# EAGLE design schema (EAGLE 8.2.2)
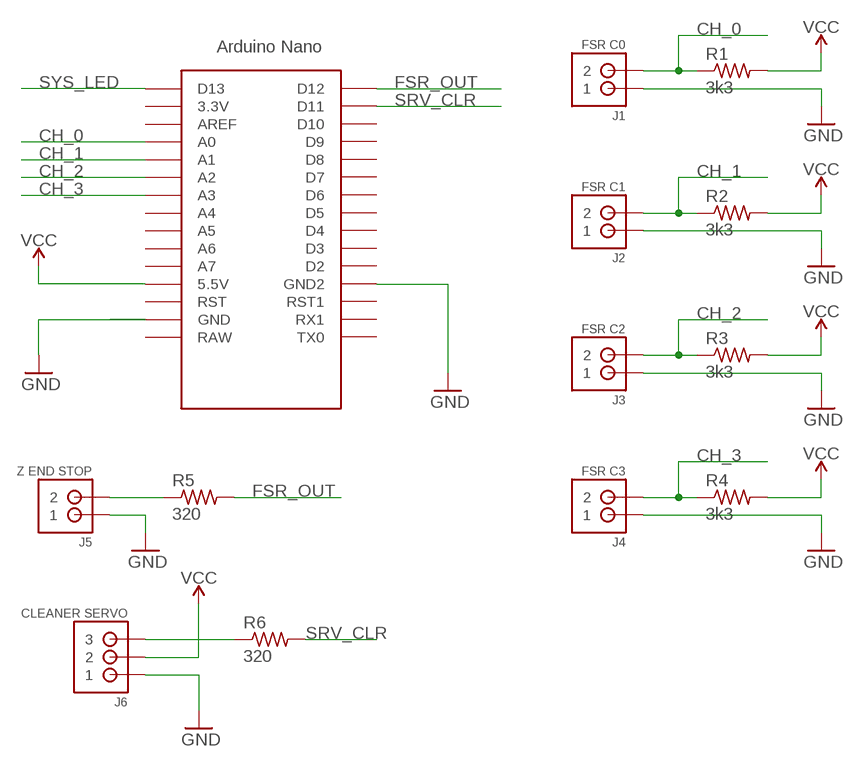
[diagram p0: schematic, sheet 1]

## Parts
J1  FSR C0  JST-PH_2-PIN_HEADER  [JST_B2B-PH_HEADER]
J2  FSR C1  JST-PH_2-PIN_HEADER  [JST_B2B-PH_HEADER]
J3  FSR C2  JST-PH_2-PIN_HEADER  [JST_B2B-PH_HEADER]
J4  FSR C3  JST-PH_2-PIN_HEADER  [JST_B2B-PH_HEADER]
J5  Z END STOP  JST-PH_2-PIN_HEADER  [JST_B2B-PH_HEADER]
J6  CLEANER SERVO  JST-PH_3-PIN_HEADER  [JST_B3B-PH_HEADER]
R1  3k3  R-US_0204/5  [0204/5]
R2  3k3  R-US_0204/5  [0204/5]
R3  3k3  R-US_0204/5  [0204/5]
R4  3k3  R-US_0204/5  [0204/5]
R5  320  R-US_0204/5  [0204/5]
R6  320  R-US_0204/5  [0204/5]
U$1  NANO  [NANO]

## Nets
CH_0: J1.P2 R1.1 U$1.A0
CH_1: J2.P2 R2.1 U$1.A1
CH_2: J3.P2 R3.1 U$1.A2
CH_3: J4.P2 R4.1 U$1.A3
FSR_OUT: R5.2 U$1.D12
GND: J1.P1 J2.P1 J3.P1 J4.P1 J5.P1 J6.P1 U$1.GND U$1.GND1(GND2)
N$1: J6.P3 R6.1
N$5: J5.P2 R5.1
SRV_CLR: R6.2 U$1.D11
SYS_LED: U$1.D13
VCC: J6.P2 R1.2 R2.2 R3.2 R4.2 U$1.5V(5.5V)
Unconnected: U$1.3.3V U$1.A4 U$1.A5 U$1.A6 U$1.A7 U$1.AREF U$1.D2 U$1.D3 U$1.D4 U$1.D5 U$1.D6 U$1.D7 U$1.D8 U$1.D9 U$1.D10 U$1.ICSP1 U$1.ICSP2 U$1.ICSP3 U$1.ICSP4 U$1.ICSP5 U$1.ICSP6 U$1.RAW U$1.RST U$1.RST1 U$1.RX1 U$1.TX0

## Library data of the parts
J1-J5 = SRG:JST-PH_2-PIN_HEADER: 2-pin JST PH Shrouded Header, top entry P/N B2B-PH-K-S Mating connector PHR-2 Mating cable assembly: Sparkfun PRT-09914 <http://www.sparkfun.com/products/9914>
J6 = SRG:JST-PH_3-PIN_HEADER: 3-pin JST PH Shrouded Header, top entry P/N B3B-PH-K-S Mating connector PHR-3
R1-R6 = adafruit:R-US_: RESISTOR, American symbol
U$1 = Arduino-clone:NANO: Arduino Nano

## Board
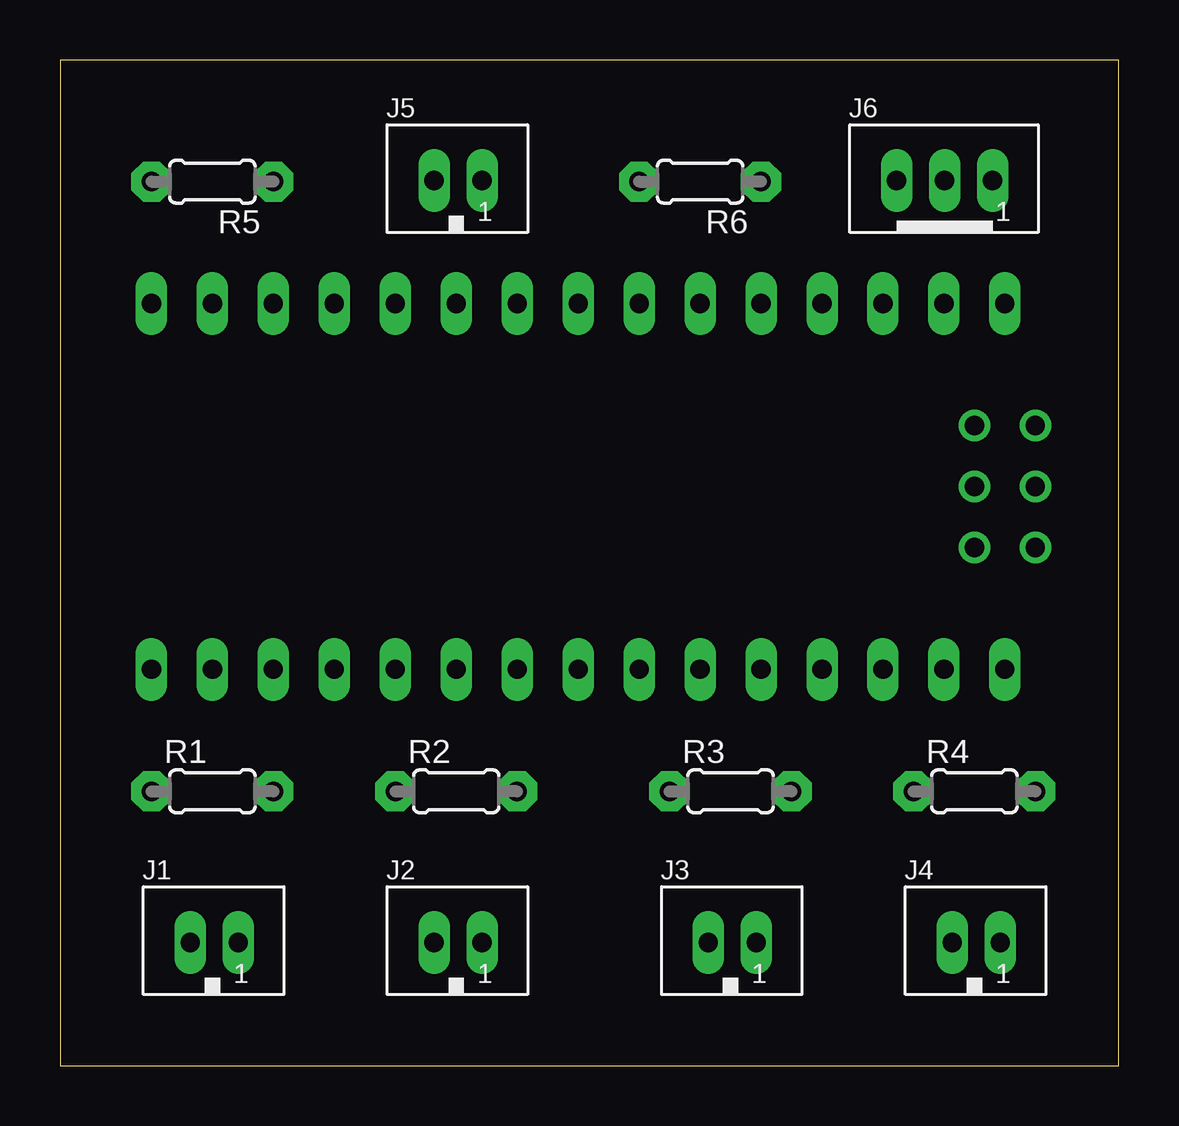
[diagram p1: board, top side]
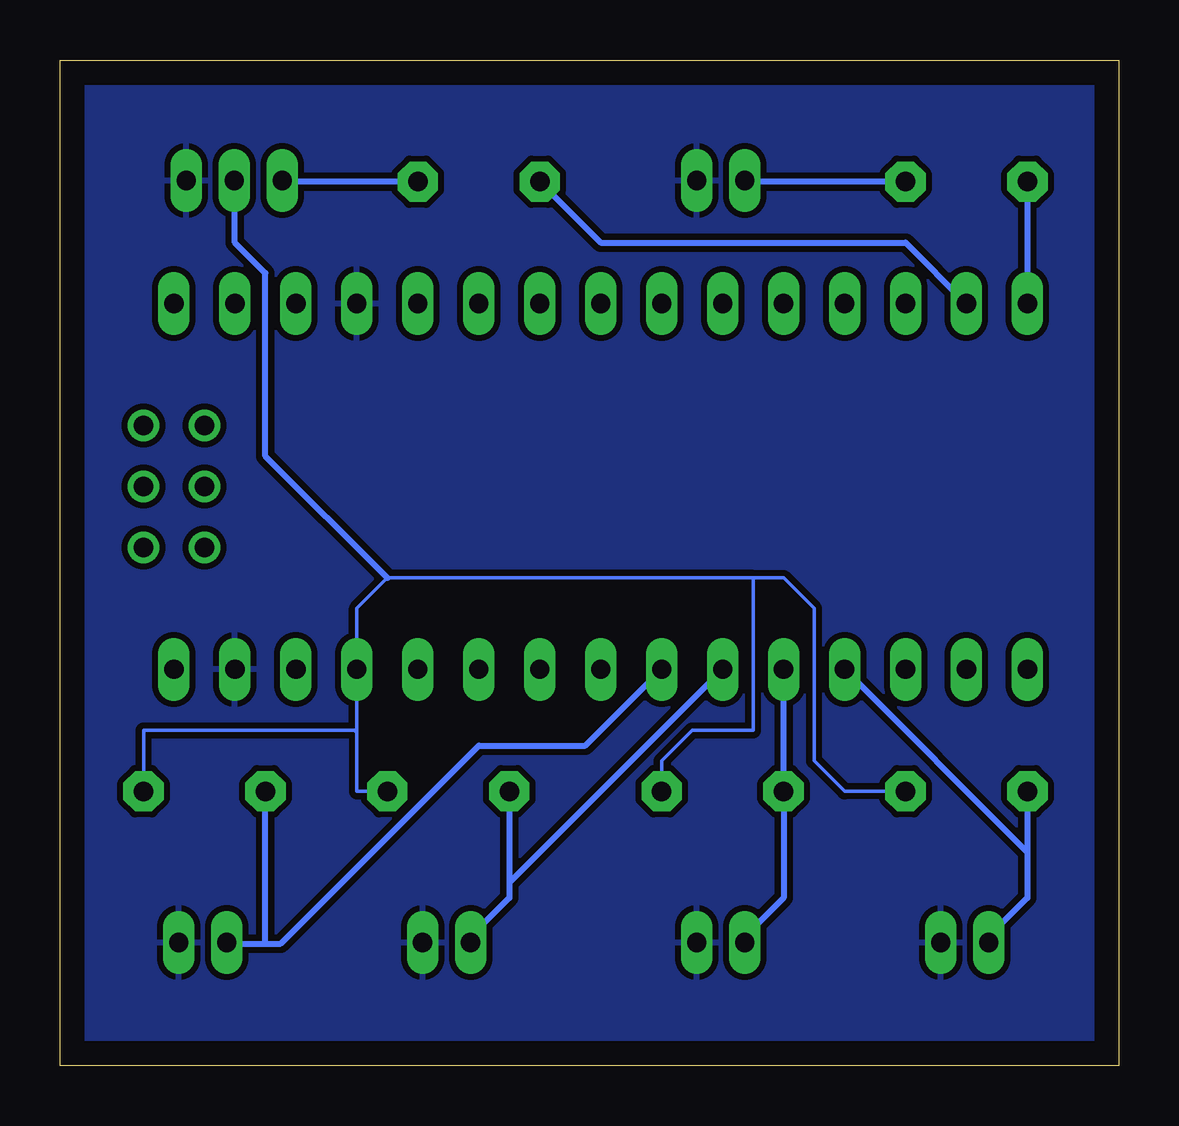
[diagram p2: board, bottom side, seen from below]

Size 44.12 x 41.9 mm. Coordinates in mm from the lower left corner, seen from the top.
Outline: 0,0 44.12,0 44.12,41.9 0,41.9 0,0
Copper layers (1*16): Top 0.035mm / dielectric 1.5mm / Bottom 0.035mm
Design rules "default *": minimum track width 10mil, minimum drill 0.35mm, track to track 10mil, track to pad 10mil, pad to pad 10mil, via to via 10mil, smd to smd 6mil, copper to edge 40mil, drill to drill 6mil, minimum pad ring 10mil, minimum via ring 8mil, stop-mask expansion 4mil, vias tented up to drill 0mil, thermal gap 10mil

### Footprints (pad centres in the part's own frame; a part is rotated, then mirrored left to right if it is on the bottom)
JST_B2B-PH_HEADER = drill 0.8 long: P1 1.075,0.048; P2 -0.925,0.048
JST_B3B-PH_HEADER = drill 0.8 long: P1 2.027,0.048; P2 0.028,0.048; P3 -1.972,0.048
0204/5 = drill 0.813 pad 1.676 octagon: 1 -2.54,0; 2 2.54,0
NANO = drill 0.8 long: 3.3V -10.16,24.13; 5V -10.16,-1.27; A0 -10.16,19.05; A1 -10.16,16.51; A2 -10.16,13.97; A3 -10.16,11.43; A4 -10.16,8.89; A5 -10.16,6.35; A6 -10.16,3.81; A7 -10.16,1.27; AREF -10.16,21.59; D2 5.08,1.27; D3 5.08,3.81; D4 5.08,6.35; D5 5.08,8.89; D6 5.08,11.43; D7 5.08,13.97; D8 5.08,16.51; D9 5.08,19.05; D10 5.08,21.59; D11 5.08,24.13; D12 5.08,26.67; D13 -10.16,26.67; GND -10.16,-6.35; GND1 5.08,-1.27; RAW -10.16,-8.89; RST -10.16,-3.81; RST1 5.08,-3.81; RX1 5.08,-6.35; TX0 5.08,-8.89 | drill 0.8: ICSP1 -5.08,-10.16; ICSP2 -5.08,-7.62; ICSP3 -2.54,-10.16; ICSP4 -2.54,-7.62; ICSP5 0,-10.16; ICSP6 0,-7.62

### Placement (x,y rotation side)
J1  6.35,5.08 0 top
J2  16.51,5.08 0 top
J3  27.94,5.08 0 top
J4  38.1,5.08 0 top
J5  16.51,36.83 0 top
J6  36.83,36.83 0 top
R1  6.35,11.43 0 top
R2  16.51,11.43 0 top
R3  27.94,11.43 0 top
R4  38.1,11.43 0 top
R5  6.35,36.83 180 top
R6  26.67,36.83 180 top
U$1  30.48,26.67 90 top

### Tracks (layer width: path | path; a pad name or v marks a point on that pad's centre or on a via)
CH_0
  Bottom 0.254: R1.1 3.81,8.89 | 3.81,8.89 3.81,6.99 5.08,5.71 J1.P2 | 3.81,8.89 U$1.A0
CH_1
  Bottom 0.254: J2.P2 15.24,5.71 13.97,6.99 R2.1 U$1.A1
CH_2
  Bottom 0.254: R3.1 25.4,7.62 | 25.4,7.62 25.4,6.99 26.67,5.71 J3.P2 | 25.4,7.62 U$1.A2
CH_3
  Bottom 0.254: U$1.A3 22.23,13.34 26.67,13.34 34.92,5.08 35.56,5.08 | 35.56,5.08 36.83,5.08 J4.P2 | 35.56,5.08 R4.1
FSR_OUT
  Bottom 0.254: R5.2 U$1.D12
GND
  pour Bottom: 0,41.91 44.45,41.91 44.45,0 0,0
N$1
  Bottom 0.254: R6.1 34.29,36.83 J6.P3
N$5
  Bottom 0.254: R5.1 15.24,36.83 J5.P2
SRV_CLR
  Bottom 0.254: U$1.D11 8.89,34.29 21.59,34.29 R6.2
VCC
  Bottom 0.152: R1.2 11.43,11.43 12.7,12.7 12.7,19.05 13.97,20.32 15.24,20.32 | 15.24,20.32 30.48,20.32 31.75,19.05 U$1.5V 31.75,13.86 | R2.2 19.05,12.7 17.78,13.97 15.24,13.97 15.24,20.32 | R3.2 31.75,11.43 31.75,13.86 | R4.2 40.64,13.97 31.86,13.97 31.75,13.86
  Bottom 0.254: 30.48,20.32 35.56,25.4 35.56,33.02 36.83,34.29 36.83,36.83 J6.P2